# Altium schematic sheet [12]IO_PORT.SchDoc
size A4
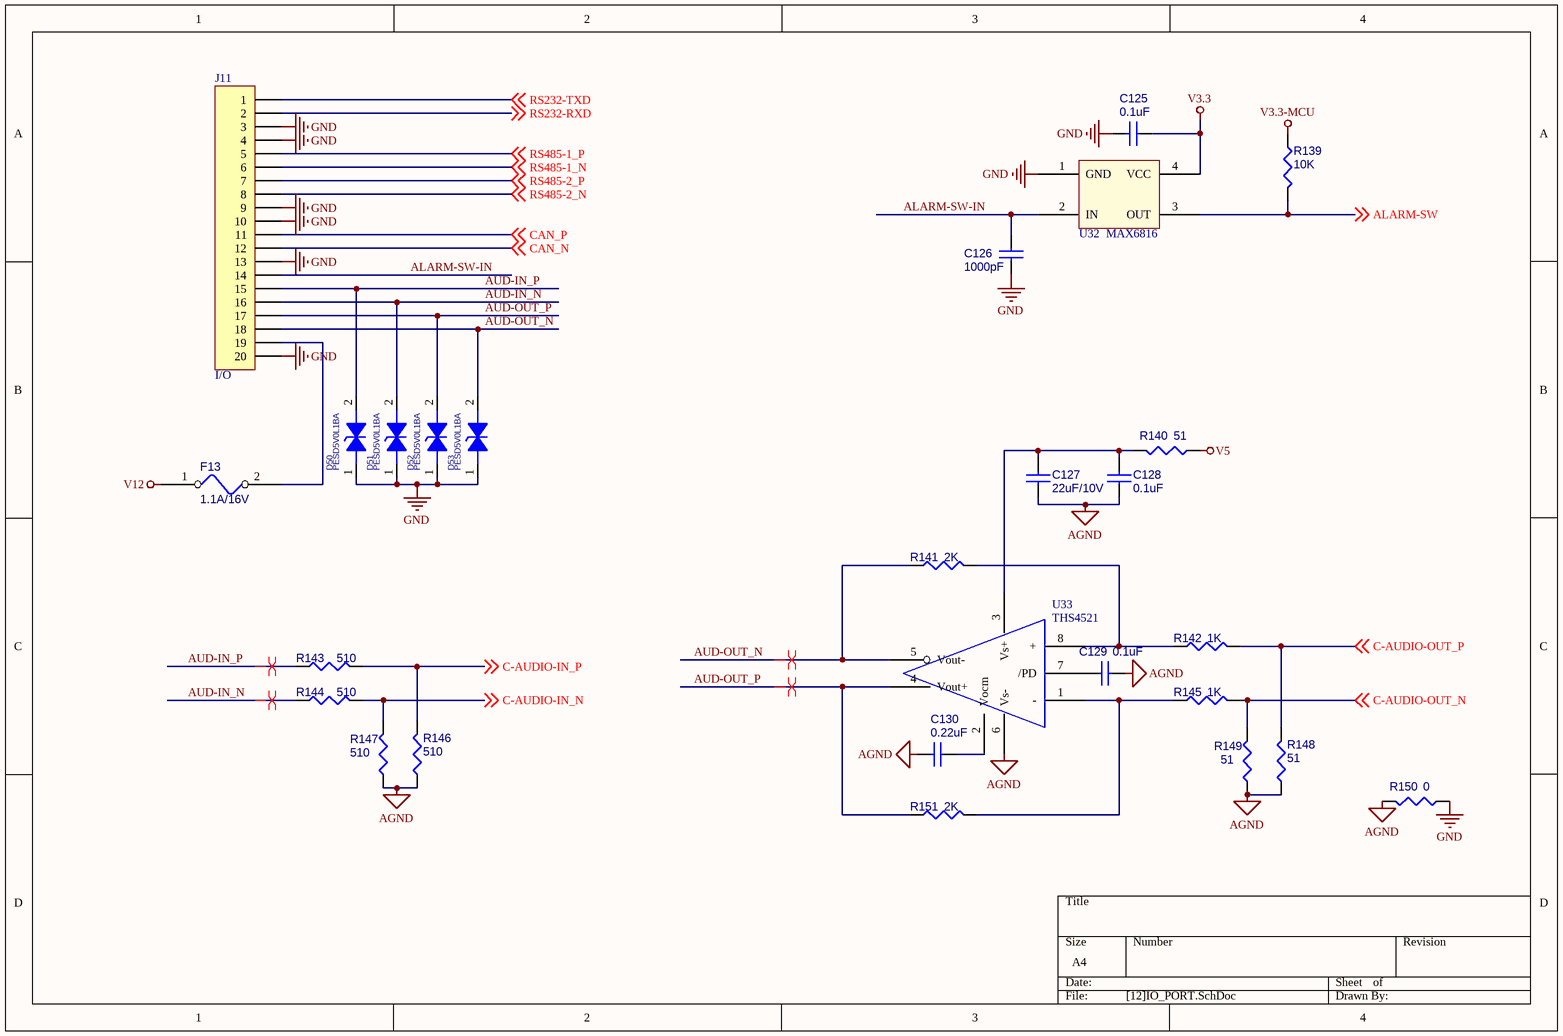
[diagram p0: [12]IO_PORT.SchDoc]

## Parts
C125  0.1uF  [0603]
C126  1000pF  [0603]
C127  22uF/10V  [1210]
C128  0.1uF  [0603]
C129  0.1uF  [0603]
C130  0.22uF  [0603]
D50  PESD5V0L1BA  [SOD323]
D51  PESD5V0L1BA  [SOD323]
D52  PESD5V0L1BA  [SOD323]
D53  PESD5V0L1BA  [SOD323]
F13  1.1A/16V  [1812]
J11  I/O  [COMM-3MM-2X10]
R139  10K  [0603]
R140  51  [0603]
R141  2K  [0603]
R142  1K  [0603]
R143  510  [0603]
R144  510  [0603]
R145  1K  [0603]
R146  510  [0603]
R147  510  [0603]
R148  51  [0603]
R149  51  [0603]
R150  0  [0603]
R151  2K  [0603]
U32  MAX6816  [SOT143]
U33  THS4521  [SO8]

## Nets
AGND: C127.1 C128.1 C129.2 C130.2 R146.2 R147.2 R148.2 R149.2 R150.1 U33.6(Vs-)
GND: C125.2 C126.2 D50.1 D51.1 D52.1 D53.1 J11.3 J11.4 J11.9 J11.10 J11.13 J11.20 R150.2 U32.1(GND)
V3.3: C125.1 U32.4(VCC)
V3.3-MCU: R139.1
V5: R140.2
V12: F13.1
ALARM-SW: R139.2 U32.3(OUT) ; off-sheet ALARM-SW
ALARM-SW-IN: C126.1 J11.14 U32.2(IN)
AUD-IN_N: D51.2 J11.16 R144.2
AUD-IN_P: D50.2 J11.15 R143.2
AUD-OUT_N: D53.2 J11.18 R141.2 U33.5(Vout-)
AUD-OUT_P: D52.2 J11.17 R151.2 U33.4(Vout+)
C-AUDIO-IN_N: R144.1 R147.1 ; off-sheet C-AUDIO-IN_N
C-AUDIO-IN_P: R143.1 R146.1 ; off-sheet C-AUDIO-IN_P
C-AUDIO-OUT_N: R145.1 R149.1 ; off-sheet C-AUDIO-OUT_N
C-AUDIO-OUT_P: R142.1 R148.1 ; off-sheet C-AUDIO-OUT_P
CAN_N: J11.12 ; off-sheet CAN_N
CAN_P: J11.11 ; off-sheet CAN_P
RS232-RXD: J11.2 ; off-sheet RS232-RXD
RS232-TXD: J11.1 ; off-sheet RS232-TXD
RS485-1_N: J11.6 ; off-sheet RS485-1_N
RS485-1_P: J11.5 ; off-sheet RS485-1_P
RS485-2_N: J11.8 ; off-sheet RS485-2_N
RS485-2_P: J11.7 ; off-sheet RS485-2_P
NetC127_2: C127.2 C128.2 R140.1 U33.3(Vs+)
NetC129_1: C129.1 U33.7(/PD)
NetC130_1: C130.1 U33.2(Vocm)
NetF13_2: F13.2 J11.19
NetR141_1: R141.1 R142.2 U33.8(+)
NetR145_2: R145.2 R151.1 U33.1(-)

## Layout directives
differential pair: AUD-IN_N, AUD-IN_P, AUD-OUT_N, AUD-OUT_P

## Library data of the parts
C125 C126 = CAP
C127-C130 = P_CAP NP
D50-D53 = PESD
F13 = 2A_32VDC_0467-002
J11 = Header 20: Header, 20-Pin; LatestRevisionDate: 17-Jul-2002; LatestRevisionNote: Re-released for DXP Platform.; Publisher: Altium Limited
R139 = R
R140-R151 = P_R